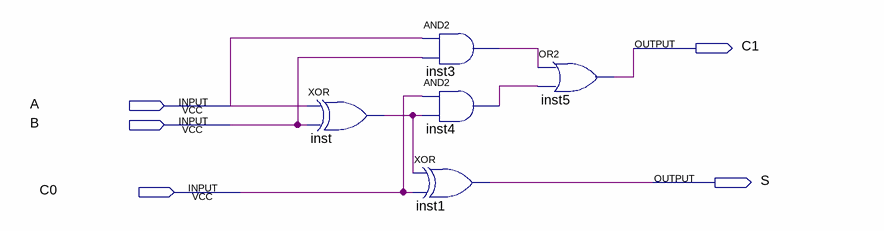
[diagram p0: schematic sheet]
// Quartus schematic adder1.bdf as structural Verilog: 5 symbols, 5 pins
module adder1 (
  input  A,
  input  B,
  input  C0,
  output C1,
  output S
);

  wire inst3_out, inst4_out, inst_out;

  xor inst (inst_out, A, B);
  and inst3 (inst3_out, A, B);
  and inst4 (inst4_out, C0, inst_out);
  xor inst1 (S, inst_out, C0);
  or inst5 (C1, inst3_out, inst4_out);
endmodule
